# Altium schematic sheet Ethernet1_RMII.SchDoc: Ethernet1 - RMII - WoL support
size A3; Project: Project name; Date: Not used; ApprovedBy: Not used; CheckedBy: Not used; Author: Not used; CompanyName: STMicroelectronics; DrawnBy: Not used; Engineer: Not used; Organization: Not used; Address1: Not used; Address2: Not used; Address3: Not used; Address4: Not used; DocumentNumber: 7; Revision: Not used; SheetNumber: 7; SheetTotal: 17; CurrentTime: Not used; CurrentDate: Not used; Time: Not used; DocumentFullPathAndName: Not used; DocumentName: Not used; ModifiedDate: Not used; ImagePath: Not used; ProjectName: Not used; Application_BuildNumber: Not used
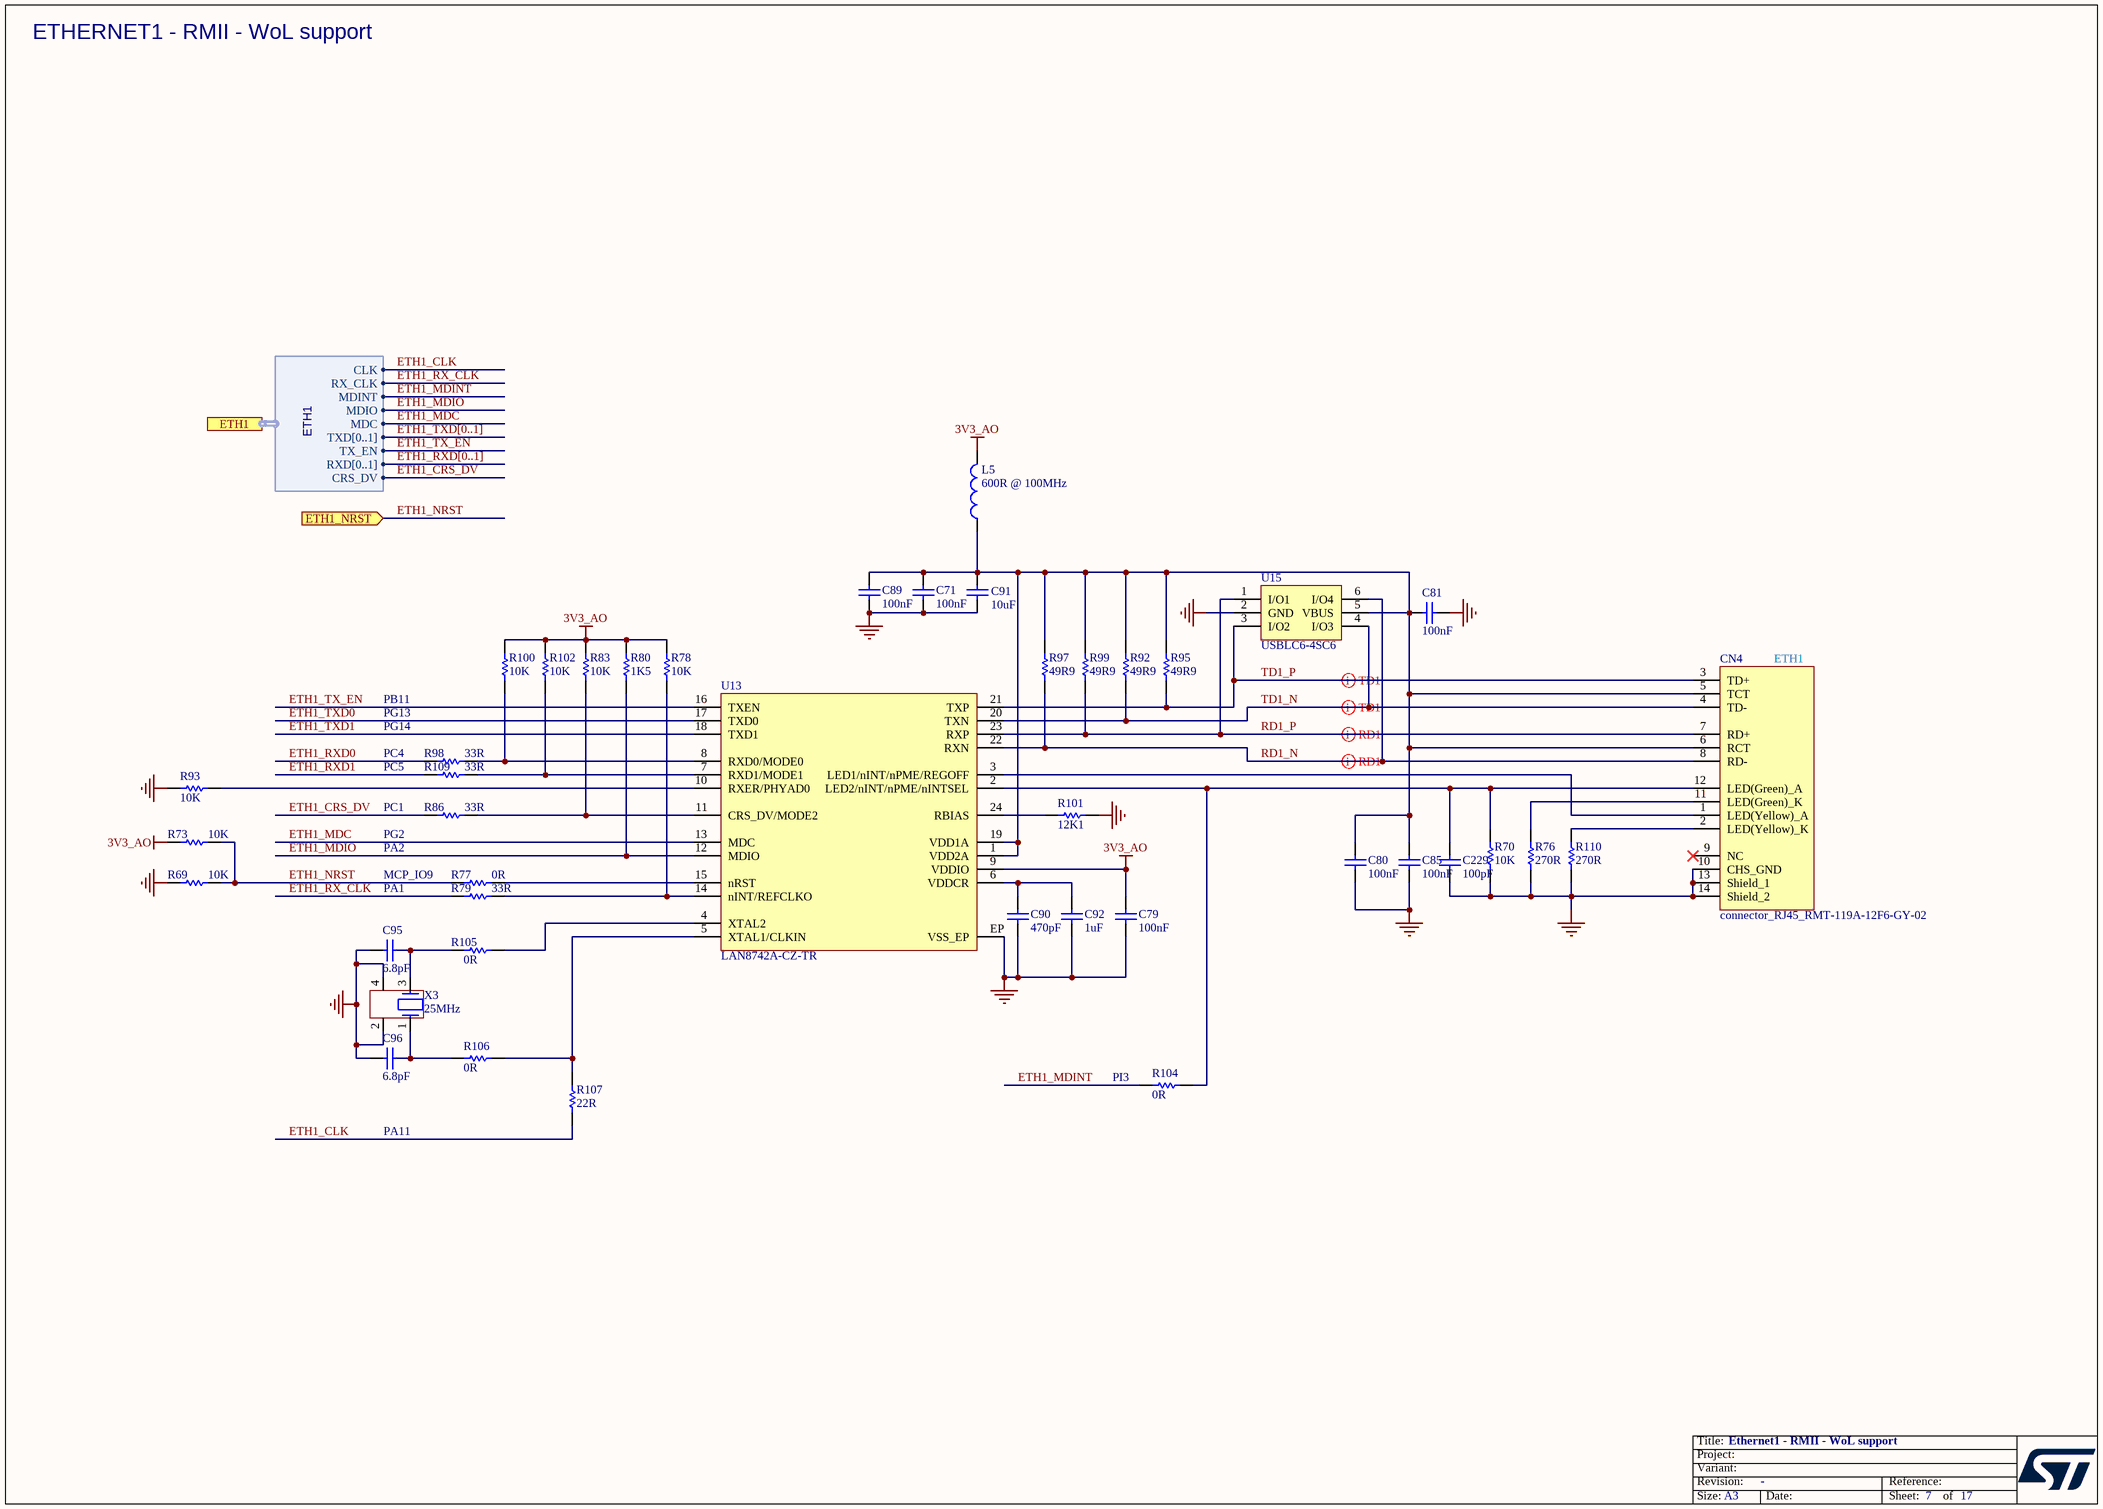
[diagram p0: Ethernet1_RMII.SchDoc]

## Parts
C71  value 100nF  [C0402]  (hidden comment: Capacitor)
C79  value 100nF  [C0402]  (hidden comment: Capacitor)
C80  value 100nF  [C0402]  (hidden comment: Capacitor)
C81  value 100nF  [C0402]  (hidden comment: Capacitor)
C85  value 100nF  [C0402]  (hidden comment: Capacitor)
C89  value 100nF  [C0402]  (hidden comment: Capacitor)
C90  value 470pF  [C0402]  (hidden comment: Capacitor)
C91  value 10uF  [C0603]  (hidden comment: Capacitor)
C92  value 1uF  [C0201_MURATA_GRM033_H0P3]  (hidden comment: Capacitor)
C95  value 6.8pF  [C0402]  (hidden comment: Capacitor)
C96  value 6.8pF  [C0402]  (hidden comment: Capacitor)
C229  value 100pF  [C0402]  (hidden comment: Capacitor)
CN4  value connector_RJ45_RMT-119A-12F6-GY-02  [CON_RJ45_PHC_RMT-119A-12F6-GY-02]  (hidden comment: RJ45_RTS-119A-12F6-GY-02)
L5  value 600R @ 100MHz  [L0603]  (hidden comment: BEAD)
R69  value 10K  [R0402]  (hidden comment: Resistor)
R70  value 10K  [R0402]  (hidden comment: Resistor)
R73  value 10K  [R0402]  (hidden comment: Resistor)
R76  value 270R  [R0402]  (hidden comment: Resistor)
R77  value 0R  [R0402]  (hidden comment: Resistor)
R78  value 10K  [R0402]  (hidden comment: Resistor)
R79  value 33R  [R0402]  (hidden comment: Resistor)
R80  value 1K5  [R0402]  (hidden comment: Resistor)
R83  value 10K  [R0402]  (hidden comment: Resistor)
R86  value 33R  [R0402]  (hidden comment: Resistor)
R92  value 49R9  [R0402]  (hidden comment: Resistor)
R93  value 10K  [R0402]  (hidden comment: Resistor)
R95  value 49R9  [R0402]  (hidden comment: Resistor)
R97  value 49R9  [R0402]  (hidden comment: Resistor)
R98  value 33R  [R0402]  (hidden comment: Resistor)
R99  value 49R9  [R0402]  (hidden comment: Resistor)
R100  value 10K  [R0402]  (hidden comment: Resistor)
R101  value 12K1  [R0402]  (hidden comment: Resistor)
R102  value 10K  [R0402]  (hidden comment: Resistor)
R104  value 0R  [R0402]  (hidden comment: Resistor)
R105  value 0R  [R0402]  (hidden comment: Resistor)
R106  value 0R  [R0402]  (hidden comment: Resistor)
R107  value 22R  [R0402]  (hidden comment: Resistor)
R109  value 33R  [R0402]  (hidden comment: Resistor)
R110  value 270R  [R0402]  (hidden comment: Resistor)
U13  LAN8742A-CZ-TR  [ICC_VQFN24-EPAD_4X4_P050]
U15  USBLC6-4SC6  [ESD_SOT23-6L]
X3  value 25MHz  [CRY_NX2016SA_4P]  (hidden comment: XTAL_4_PINS)

## Ports
ETH1 (harness ETH1), ETH1_NRST (in)

## Harnesses
ETH1: MDINT, TXD[0..1], MDIO, MDC, RX_CLK, TX_EN, RXD[0..1], CRS_DV, CLK

## Nets
3V3_AO: C79.2 L5.2 R73.2 R78.2 R80.2 R83.2 R100.2 R102.2 U13.9(VDDIO)
GND: C71.1 C79.1 C80.1 C81.2 C85.1 C89.1 C90.1 C91.2 C92.1 C95.1 C96.1 C229.1 CN4.10(CHS_GND) CN4.13(Shield_1) CN4.14(Shield_2) R69.2 R70.1 R76.1 R93.2 R101.2 R110.1 U13.EP(VSS_EP) U15.2(GND) X3.2 X3.4
ETH1_CLK: R107.1 ; port ETH1.CLK
ETH1_CRS_DV: R86.1 ; port ETH1.CRS_DV
ETH1_MDC: U13.13(MDC) ; port ETH1.MDC
ETH1_MDINT: R104.1 ; port ETH1.MDINT
ETH1_MDIO: R80.1 U13.12(MDIO) ; port ETH1.MDIO
ETH1_NRST: R69.1 R73.1 R77.1 ; port ETH1_NRST
ETH1_RX_CLK: R79.1 ; port ETH1.RX_CLK
ETH1_RXD0: R98.1
ETH1_RXD1: R109.1
ETH1_TX_EN: U13.16(TXEN) ; port ETH1.TX_EN
ETH1_TXD0: U13.17(TXD0)
ETH1_TXD1: U13.18(TXD1)
RD1_N: CN4.8(RD-) R97.1 U13.22(RXN) U15.6(I/O4)
RD1_P: CN4.7(RD+) R99.1 U13.23(RXP) U15.1(I/O1)
TD1_N: CN4.4(TD-) R92.1 U13.20(TXN) U15.4(I/O3)
TD1_P: CN4.3(TD+) R95.1 U13.21(TXP) U15.3(I/O2)
NetC71_2: C71.2 C80.2 C81.1 C85.2 C89.2 C91.1 CN4.5(TCT) CN4.6(RCT) L5.1 R92.2 R95.2 R97.2 R99.2 U13.1(VDD2A) U13.19(VDD1A) U15.5(VBUS)
NetC90_2: C90.2 C92.2 U13.6(VDDCR)
NetC95_2: C95.2 R105.1 X3.3
NetC96_2: C96.2 R106.1 X3.1
NetC229_2: C229.2 CN4.12(LED(Green)_A) R70.2 R104.2 U13.2(LED2/nINT/nPME/nINTSEL)
NetCN4_1: CN4.1(LED(Yellow)_A) U13.3(LED1/nINT/nPME/REGOFF)
NetCN4_2: CN4.2(LED(Yellow)_K) R110.2
NetCN4_11: CN4.11(LED(Green)_K) R76.2
NetR77_2: R77.2 U13.15(nRST)
NetR78_1: R78.1 R79.2 U13.14(nINT/REFCLKO)
NetR83_1: R83.1 R86.2 U13.11(CRS_DV/MODE2)
NetR93_1: R93.1 U13.10(RXER/PHYAD0)
NetR98_2: R98.2 R100.1 U13.8(RXD0/MODE0)
NetR101_1: R101.1 U13.24(RBIAS)
NetR102_1: R102.1 R109.2 U13.7(RXD1/MODE1)
NetR105_2: R105.2 U13.4(XTAL2)
NetR106_2: R106.2 R107.2 U13.5(XTAL1/CLKIN)

Not connected (* = marked no-connect by the designer): CN4 9(NC)*

## Buses and harness runs
bus ETH1_RXD[0..1]
bus ETH1_TXD[0..1]

## Layout directives
differential pair: RD1_N, RD1_P, TD1_N, TD1_P

## Notes on the sheet
- ETHERNET1 - RMII - WoL support
- PB11
- PG13
- ETH1
- PC4
- PC5
- PG14
- PC1
- (near R86) PG2
- PA2
- PA1
- MCP_IO9
- (near R104) PI3
- PA11
- Title:
- Project:
- Size:
- Revision:
- Variant:
- A3
- -
- Date:
- Reference:
- Sheet:
- of

## Library data of the parts
C71 C79-C81 C85 C89 = MCD-00006: Capacitor, MLCC, 100nF, 16V, X7R, +/-10%, 0402, T=0.5mm; Manufacturer_Part_Number: CC0402KRX7R7BB104; Manufacturer: YAGEO; Part_Preference: Recommended; Order_Code_RS: 616-9701; Component_Country_Of_Origin: China; ShowFields: YES; ID: 2474; Internal_Part_Number: MCD-00006; Status: Released; Part_Type: Capacitor; Package: 0402; ComponentLink1URL: http://tunmcdsvn.tun.st.com/Component_Documentation_Library/Trunk/Capacitor/YAGEO_X7R_Series; Order_Code_Digikey: 311-1338-1-ND; Order_Code_Farnell: 9402047
C90 = MCD-00724: Capacitor, MLCC, 470pF, 50V, NPO, +/-5%, 0402, T=0.5mm; Manufacturer_Part_Number: CC0402JRNPO9BN471; Manufacturer: YAGEO; Part_Preference: Recommended; Order_Code_RS: 199-2186; Component_Country_Of_Origin: China; ShowFields: YES; ID: 3023; Internal_Part_Number: MCD-00724; Status: Released; Part_Type: Capacitor; Package: 0402; ComponentLink1URL: http://tunmcdsvn.tun.st.com/Component_Documentation_Library/Trunk/Capacitor/YAGEO_NP0_Series; Order_Code_Digikey: 311-1671-1-ND; Order_Code_Farnell: 3366416
C91 = MCD-00099: Capacitor, MLCC, 10uF, 10V, X5R, +/-10%, 0603, T=0.8mm; Manufacturer_Part_Number: GRM188R61A106KE69D; Manufacturer: MURATA; Part_Preference: Recommended; Order_Code_RS: 170-6168; Component_Country_Of_Origin: Japan; ShowFields: YES; ID: 2770; Internal_Part_Number: MCD-00099; Status: Released; Part_Type: Capacitor; Package: 0603; ComponentLink1URL: http://tunmcdsvn.tun.st.com/Component_Documentation_Library/Trunk/Capacitor/MURATA_GRM_Series; Order_Code_Digikey: 490-10474-1-ND; Order_Code_Farnell: 2494233
C92 = MCD-02377: Capacitor, MLCC, 1uF, 6.3V, X5R, +/-20%, 0201, T=0,3mm; Manufacturer_Part_Number: GRM033R60J105MEA2; Manufacturer: MURATA; Part_Preference: Recommended; Order_Code_RS: 820-0643; Component_Country_Of_Origin: Japan; ShowFields: YES; ID: 4483; Internal_Part_Number: MCD-02377; Status: Checked; Part_Type: Capacitor; Package: 0201; ComponentLink1URL: http://tunmcdsvn.tun.st.com/Component_Documentation_Library/Trunk/Capacitor/MURATA_GRM_Series/GRM033R60J105MEA2/; Order_Code_Digikey: 490-7229-2-ND; Order_Code_Farnell: 2470448
C95 C96 = MCD-00674: Capacitor, MLCC, 6.8pF, 50V, NPO, +/-0.25pF, 0402, T=0.5mm; Manufacturer_Part_Number: CC0402CRNPO9BN6R8; Manufacturer: YAGEO; Part_Preference: Recommended; Component_Country_Of_Origin: China; ShowFields: YES; ID: 3068; Internal_Part_Number: MCD-00674; Status: Released; Part_Type: Capacitor; Package: 0402; ComponentLink1URL: http://tunmcdsvn.tun.st.com/Component_Documentation_Library/Trunk/Capacitor/YAGEO_NP0_Series; Order_Code_Digikey: 311-3327-1-ND; Order_Code_Farnell: N/A; Order_Code_RS: N/A
C229 = MCD-00205: Capacitor, MLCC, 100pF, 50V, NPO, +/-5%, 0402, T=0.5mm; Manufacturer_Part_Number: CC0402JRNPO9BN101; Manufacturer: YAGEO; Part_Preference: Recommended; Component_Country_Of_Origin: China; ShowFields: YES; ID: 2658; Internal_Part_Number: MCD-00205; Status: Released; Part_Type: Capacitor; Package: 0402; ComponentLink1URL: http://tunmcdsvn.tun.st.com/Component_Documentation_Library/Trunk/Capacitor/YAGEO_NP0_Series; Order_Code_Digikey: 311-1024-1-ND; Order_Code_Farnell: 3019226RL; Order_Code_RS: N/A
CN4 = MCD-02475: connector_RJ45, 10/100 Ethernet integrated MAG with integrate Green and Yellow LED, T= 13.61mm; Part_Preference: Recommended; Manufacturer: PENGHUI; Manufacturer_Part_Number: RMT-119A-12F6-GY-02; ShowFields: YES; ID: 4581; Internal_Part_Number: MCD-02475; Status: Released; Part_Type: Connector; ComponentLink1URL: http://tunmcdsvn.tun.st.com/Component_Documentation_Library/Trunk/Connector/PENGHUI_RMT-119A-12F6-GY-02; Order_Code_Digikey: N/A; Order_Code_Farnell: N/A; Order_Code_RS: N/A
L5 = MCD-00047: Ferrite bead, 600R @1 00MHz, +/-25%, 350mA, 0R5, 0603, T=0.8mm; Part_Type: Inductor; Manufacturer_Part_Number: FCM1608KF-601T03; Manufacturer: TAI-TECH; Part_Preference: Recommended; Component_Country_Of_Origin: Unknown; ShowFields: YES; ID: 2546; Internal_Part_Number: MCD-00047; Status: Released; ComponentLink1URL: http://tunmcdsvn.tun.st.com/Component_Documentation_Library/Trunk/Inductor/TAI-TECH_FCM-1608_Series; Package: 0603; Order_Code_Digikey: N/A; Order_Code_Farnell: N/A; Order_Code_RS: N/A
R69 R73 = MCD-00053: Resistor, 10K, 0402, +/-1%, 1/16W; Manufacturer_Part_Number: RC0402FR-0710KL; Manufacturer: YAGEO; Part_Preference: Recommended; BMS_Part_Number: 9131590; Component_Country_Of_Origin: China; ShowFields: YES; ID: 2539; Internal_Part_Number: MCD-00053; Status: Released; Part_Type: Resistor; Package: 0402; ComponentLink1URL: http://tunmcdsvn.tun.st.com/Component_Documentation_Library/Trunk/Resistor/YAGEO_RC_L_Series; Order_Code_Digikey: 311-10.0KLRCT-ND; Order_Code_Farnell: 9239359; Order_Code_RS: N/A
R70 R78 R83 R93 R100 R102 = MCD-00053: Resistor, 10K, 0402, +/-1%, 1/16W; Manufacturer_Part_Number: RC0402FR-0710KL; Manufacturer: YAGEO; BMS_Part_Number: 9131590; Part_Preference: Recommended; Component_Country_Of_Origin: China; ShowFields: YES; ID: 2539; Internal_Part_Number: MCD-00053; Status: Released; Part_Type: Resistor; Package: 0402; ComponentLink1URL: http://tunmcdsvn.tun.st.com/Component_Documentation_Library/Trunk/Resistor/YAGEO_RC_L_Series; Order_Code_Digikey: 311-10.0KLRCT-ND; Order_Code_Farnell: 9239359; Order_Code_RS: N/A
R76 R110 = MCD-00441: Resistor, 270R, 0402, +/-1%, 1/16W; Manufacturer_Part_Number: RC0402FR-07270RL; Manufacturer: YAGEO; Part_Preference: Recommended; Component_Country_Of_Origin: China; ShowFields: YES; ID: 2838; Internal_Part_Number: MCD-00441; Status: Released; Part_Type: Resistor; Package: 0402; ComponentLink1URL: http://tunmcdsvn.tun.st.com/Component_Documentation_Library/Trunk/Resistor/YAGEO_RC_L_Series; Order_Code_Digikey: 311-270LRCT-ND; Order_Code_Farnell: 9239162; Order_Code_RS: N/A
R77 = MCD-00052: Resistor, 0R, 0402, +/-5%, 1/16W; Part_Preference: Recommended; Manufacturer: YAGEO; Manufacturer_Part_Number: RC0402JR-070RL; Order_Code_RS: 618-5804; Component_Country_Of_Origin: China; ShowFields: YES; ID: 2540; Internal_Part_Number: MCD-00052; Status: Released; Part_Type: Resistor; Package: 0402; ComponentLink1URL: http://tunmcdsvn.tun.st.com/Component_Documentation_Library/Trunk/Resistor/YAGEO_RC_L_Series; Order_Code_Digikey: 311-0.0JRCT-ND; Order_Code_Farnell: 9232516RL
R79 R86 R98 R109 = MCD-00455: Resistor, 33R, 0402, +/-1%, 1/16W; Manufacturer_Part_Number: RC0402FR-0733RL; Manufacturer: YAGEO; Part_Preference: Recommended; Component_Country_Of_Origin: China; ShowFields: YES; ID: 2821; Internal_Part_Number: MCD-00455; Status: Released; Part_Type: Resistor; Package: 0402; ComponentLink1URL: http://tunmcdsvn.tun.st.com/Component_Documentation_Library/Trunk/Resistor/YAGEO_RC_L_Series; Order_Code_Digikey: 311-33.0LRCT-ND; Order_Code_Farnell: 9239057; Order_Code_RS: N/A
R80 = MCD-00068: Resistor, 1K5, 0402, +/-1%, 1/16W; Manufacturer_Part_Number: RC0402FR-071K5L; Manufacturer: YAGEO; Part_Preference: Recommended; Component_Country_Of_Origin: China; ShowFields: YES; ID: 2524; Internal_Part_Number: MCD-00068; Status: Released; Part_Type: Resistor; Package: 0402; ComponentLink1URL: http://tunmcdsvn.tun.st.com/Component_Documentation_Library/Trunk/Resistor/YAGEO_RC_L_Series; Order_Code_Digikey: 311-1.50KLRCT-ND; Order_Code_Farnell: 9239251; Order_Code_RS: N/A
R92 R95 R97 R99 = MCD-00565: Resistor, 49R9, 0402, +/-1%, 1/16W; Manufacturer_Part_Number: RC0402FR-0749R9L; Manufacturer: YAGEO; Part_Preference: Recommended; Component_Country_Of_Origin: China; ShowFields: YES; ID: 3178; Internal_Part_Number: MCD-00565; Status: Released; Part_Type: Resistor; Package: 0402; ComponentLink1URL: http://tunmcdsvn.tun.st.com/Component_Documentation_Library/Trunk/Resistor/YAGEO_RC_L_Series; Order_Code_Digikey: 311-49.9LRCT-ND; Order_Code_Farnell: 1799218; Order_Code_RS: N/A
R101 = MCD-00723: Resistor, 12K1, 0402, +/-1%, 1/16W; Manufacturer_Part_Number: RC0402FR-0712K1L; Manufacturer: YAGEO; Part_Preference: Recommended; Component_Country_Of_Origin: China; ShowFields: YES; ID: 3022; Internal_Part_Number: MCD-00723; Status: Released; Part_Type: Resistor; Package: 0402; ComponentLink1URL: http://tunmcdsvn.tun.st.com/Component_Documentation_Library/Trunk/Resistor/YAGEO_RC_L_Series; Order_Code_Digikey: 311-12.1KLRCT-ND; Order_Code_Farnell: 1799183; Order_Code_RS: N/A
R104-R106 = MCD-00052: Resistor, 0R, 0402, +/-5%, 1/16W; Manufacturer_Part_Number: RC0402JR-070RL; Manufacturer: YAGEO; Part_Preference: Recommended; Order_Code_RS: 618-5804; Component_Country_Of_Origin: China; ShowFields: YES; ID: 2540; Internal_Part_Number: MCD-00052; Status: Released; Part_Type: Resistor; Package: 0402; ComponentLink1URL: http://tunmcdsvn.tun.st.com/Component_Documentation_Library/Trunk/Resistor/YAGEO_RC_L_Series; Order_Code_Digikey: 311-0.0JRCT-ND; Order_Code_Farnell: 9232516RL
R107 = MCD-00189: Resistor, 22R, 0402, +/-1%, 1/16W; Manufacturer_Part_Number: RC0402FR-0722RL; Manufacturer: YAGEO; Part_Preference: Recommended; Component_Country_Of_Origin: China; ShowFields: YES; ID: 2677; Internal_Part_Number: MCD-00189; Status: Released; Part_Type: Resistor; ComponentLink1URL: http://tunmcdsvn.tun.st.com/Component_Documentation_Library/Trunk/Resistor/YAGEO_RC_L_Series; Package: 0402; Order_Code_Digikey: 311-22.0LRCT-ND; Order_Code_Farnell: 9239030; Order_Code_RS: N/A
U13 = MCD-00719: 10/100M RMII Ethernet transceiver; Part_Type: IC; Manufacturer: MICROCHIP; BMS_Part_Number: 9177984; Part_Preference: Recommended; Component_Country_Of_Origin: Unknown; ShowFields: YES; ID: 3026; Internal_Part_Number: MCD-00719; Value: LAN8742A-CZ-TR; Status: Released; Manufacturer_Part_Number: LAN8742A-CZ-TR; ComponentLink1URL: http://tunmcdsvn.tun.st.com/Component_Datasheet_Library/Trunk/IC/MICROCHIP_LAN8742A_RMII_PHY
U15 = MCD-00250: Very low capacitance ESD protection , 4 lines; Part_Type: IC; Manufacturer: STMICROELECTRONICS; BMS_Part_Number: 9151001; Part_Preference: Recommended; Manufacturer_HQ_COO: EU; Component_Country_Of_Origin: China; ShowFields: YES; ID: 2616; Internal_Part_Number: MCD-00250; Value: USBLC6-4SC6; Status: Released; Manufacturer_Part_Number: USBLC6-4SC6; ComponentLink1URL: http://tunmcdsvn.tun.st.com/Component_Datasheet_Library/Trunk/Diodes/STM_ESD_USBLC6-4SC6
X3 = MCD-01364: Crystal, 25MHz, 6pF, +/-20ppm, 80R, 2x1.6mm; BMS_Part_Number: 9157044; Part_Preference: Recommended; Part_Type: Crystal_Osc; Manufacturer: NDK; Manufacturer_Part_Number: NX2016SA-25MHZ-EXS00A-CS11321; Component_Country_Of_Origin: Unknown; ShowFields: YES; ID: 3464; Internal_Part_Number: MCD-01364; Status: Released; Package: 2x1.6mm; ComponentLink1URL: http://tunmcdsvn.tun.st.com/Component_Documentation_Library/Trunk/Crytal_Oscillator/NDK_NX2016SA_Series; Order_Code_Digikey: 644-1367; Order_Code_Farnell: N/A; Order_Code_RS: N/A